# EAGLE design LED1 (EAGLE 9.6.0)
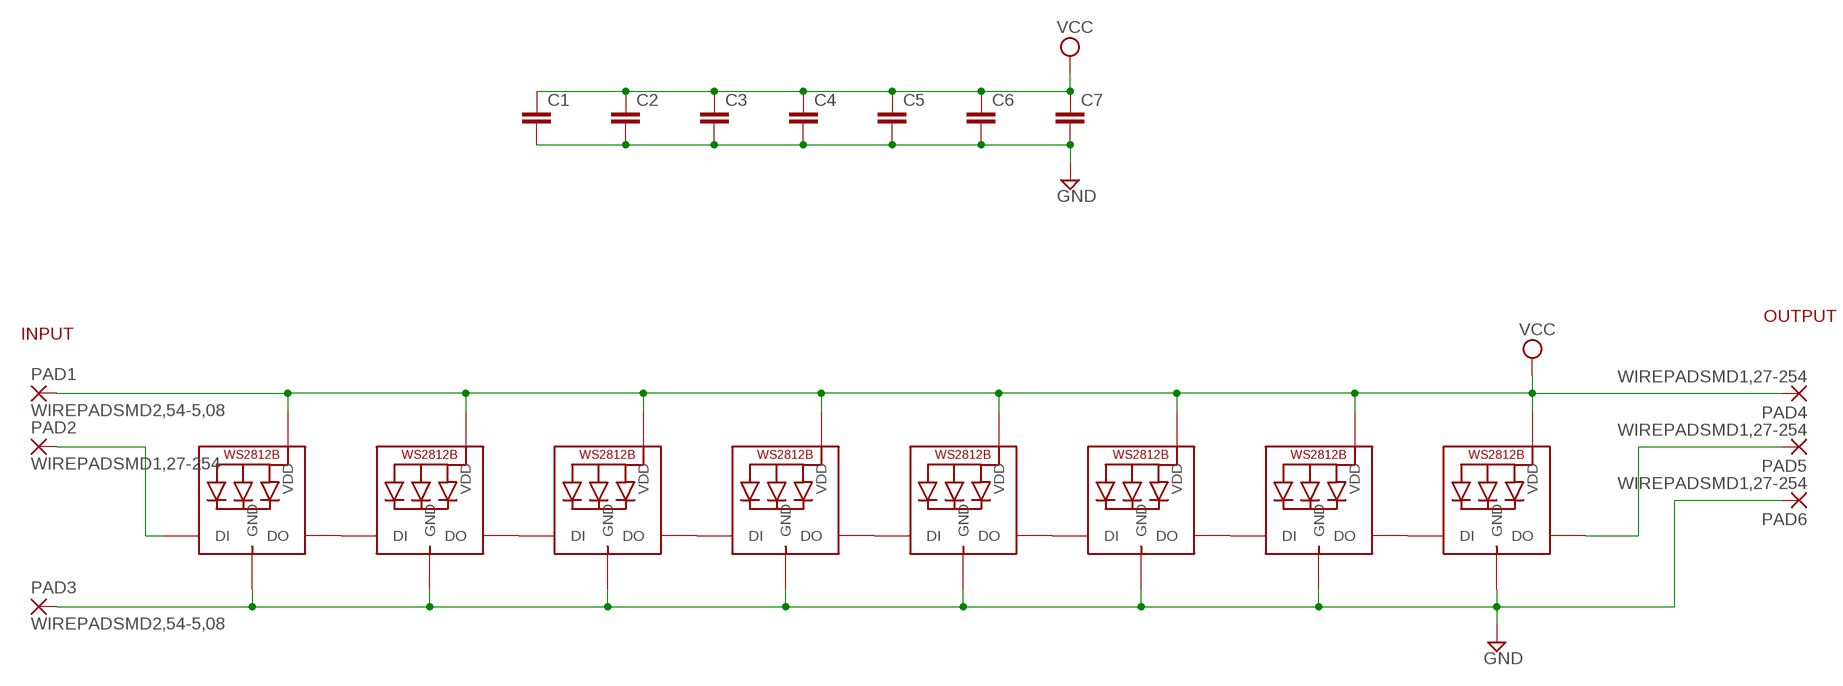
[diagram p0: schematic, sheet 1]

## Parts
C1  C-EUC0805K  [C0805K]
C2  C-EUC0805K  [C0805K]
C3  C-EUC0805K  [C0805K]
C4  C-EUC0805K  [C0805K]
C5  C-EUC0805K  [C0805K]
C6  C-EUC0805K  [C0805K]
C7  C-EUC0805K  [C0805K]
LED1  WS2812B5050  [WS2812B]
LED2  WS2812B5050  [WS2812B]
LED3  WS2812B5050  [WS2812B]
LED4  WS2812B5050  [WS2812B]
LED5  WS2812B5050  [WS2812B]
LED6  WS2812B5050  [WS2812B]
LED7  WS2812B5050  [WS2812B]
LED8  WS2812B5050  [WS2812B]
PAD1  WIREPADSMD2,54-5,08  [SMD2,54-5,08]
PAD2  WIREPADSMD1,27-254  [SMD1,27-2,54]
PAD3  WIREPADSMD2,54-5,08  [SMD2,54-5,08]
PAD4  WIREPADSMD1,27-254  [SMD1,27-2,54]
PAD5  WIREPADSMD1,27-254  [SMD1,27-2,54]
PAD6  WIREPADSMD1,27-254  [SMD1,27-2,54]

## Nets
GND: C1.2 C2.2 C3.2 C4.2 C5.2 C6.2 C7.2 LED1.3-GND(GND) LED2.3-GND(GND) LED3.3-GND(GND) LED4.3-GND(GND) LED5.3-GND(GND) LED6.3-GND(GND) LED7.3-GND(GND) LED8.3-GND(GND) PAD3.1(P) PAD6.1(P)
N$1: LED1.2-DOUT(DO) LED2.4-DIN(DI)
N$2: LED2.2-DOUT(DO) LED3.4-DIN(DI)
N$3: LED3.2-DOUT(DO) LED4.4-DIN(DI)
N$4: LED4.2-DOUT(DO) LED5.4-DIN(DI)
N$5: LED5.2-DOUT(DO) LED6.4-DIN(DI)
N$6: LED6.2-DOUT(DO) LED7.4-DIN(DI)
N$7: LED1.4-DIN(DI) PAD2.1(P)
N$8: LED8.2-DOUT(DO) PAD5.1(P)
N$12: LED7.2-DOUT(DO) LED8.4-DIN(DI)
VCC: C1.1 C2.1 C3.1 C4.1 C5.1 C6.1 C7.1 LED1.1-VDD(VDD) LED2.1-VDD(VDD) LED3.1-VDD(VDD) LED4.1-VDD(VDD) LED5.1-VDD(VDD) LED6.1-VDD(VDD) LED7.1-VDD(VDD) LED8.1-VDD(VDD) PAD1.1(P) PAD4.1(P)

## Notes on the sheet
- OUTPUT
- INPUT

## Library data of the parts
C1-C7 = rcl:C-EU: CAPACITOR, European symbol; SPICEPREFIX: C
LED1-LED8 = adafruit:WS2812B
PAD1-PAD6 = wirepad:WIREPAD: Wire PAD connect wire on PCB

## Board
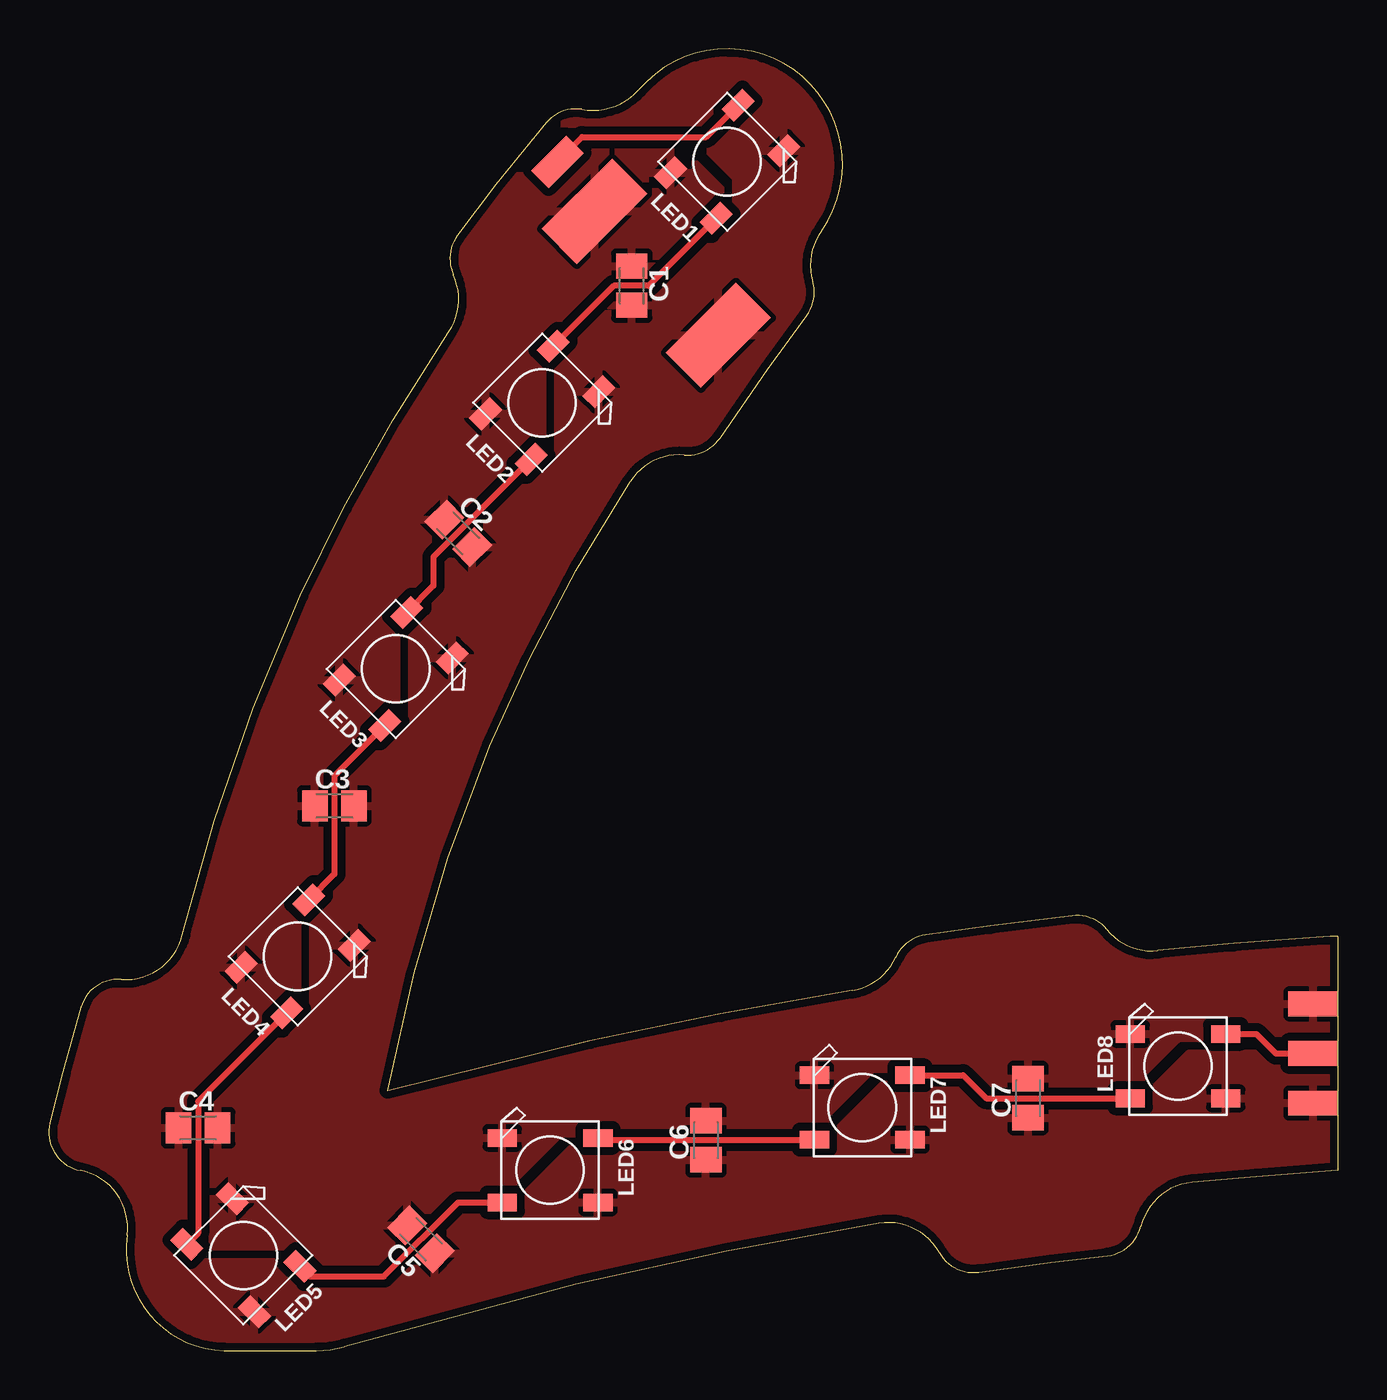
[diagram p1: board, top side]

Size 66.07 x 66.76 mm. Coordinates in mm from the lower left corner, seen from the top.
Outline: 8.98,0 13.71,0 arc17 15.15,0.21 27.01,3.4 34.72,5.1 42.53,6.53 arc-70 45.64,5.04 arc69 47.66,4.04 51.36,4.53 54.26,4.87 arc69 55.98,6.38 arc-70 58.6,8.63 61.88,8.93 66.07,9.24 66.07,21.25 arc4 65.69,21.24 60.73,20.87 56.85,20.52 arc-56 54.24,21.59 arc57 52.47,22.3 48.25,21.78 44.94,21.32 arc57 43.41,20.18 arc-56 41.17,18.47 34.42,17.27 27.73,15.88 17.37,13.33 18.73,19.36 20.46,25.23 22.61,31 24.66,35.5 27.04,40.02 29.82,44.57 arc-62 32.58,45.93 arc61 34.41,46.81 36.84,50.33 38.84,53.08 arc53 39.15,54.83 arc-52 39.61,57.43 arc175 30.24,64.65 arc-58 27.31,63.65 arc58 25.49,62.96 22.91,59.78 20.95,57.18 arc61 20.74,55.17 arc-58 20.51,52.26 17.65,47.74 15.12,43.23 12.89,38.71 10.47,32.95 8.47,27.16 6.85,21.31 arc-80 3.71,19.04 arc78 1.64,17.61 0.72,14.29 0.05,11.68 arc93 1.63,9.24 arc-87 4.01,5.92 arc96 8.98,0
Copper layers (1*16): Top 0.035559375mm / dielectric 1.6mm / Bottom 0.035559375mm
Design rules "jlcpcb2layer": minimum track width 5mil, minimum drill 8mil, track to track 5mil, track to pad 5mil, pad to pad 20mil, via to via 10mil, smd to smd 5mil, copper to edge 8mil, drill to drill 20mil, minimum pad ring 12mil, minimum via ring 5mil, stop-mask expansion 2.5mil, vias tented up to drill 20mil, thermal gap 10mil

### Footprints (pad centres in the part's own frame; a part is rotated, then mirrored left to right if it is on the bottom)
C0805K = smd 1.3 x 1.6: 1 -1,0; 2 1,0
WS2812B = smd 1.5 x 0.9: 1-VDD 2.45,-1.65; 2-DOUT 2.45,1.65; 3-GND -2.45,1.65; 4-DIN -2.45,-1.65
SMD2,54-5,08 = smd 2.54 x 5.08: 1 0,0
SMD1,27-2,54 = smd 1.27 x 2.54: 1 0,0

### Placement (x,y rotation side)
C1  29.88,54.61 270 top
C2  20.99,41.91 315 top
C3  14.64,27.94 0 top
C4  7.65,11.43 0 top
C5  19.08,5.71 135 top
C6  33.69,10.79 90 top
C7  50.2,12.95 90 top
LED1  34.77,60.97 225 top
LED2  25.29,48.61 225 top
LED3  17.78,34.96 225 top
LED4  12.76,20.22 225 top
LED5  9.98,4.89 315 top
LED6  25.7,9.26 0 top
LED7  41.7,12.48 0 top
LED8  57.88,14.59 0 top
PAD1  27.97,58.42 135 top
PAD2  26.07,60.96 135 top
PAD3  34.32,52.07 135 top
PAD4  64.8,12.7 90 top
PAD5  64.8,15.25 90 top
PAD6  64.8,17.78 90 top

### Tracks (layer width: path | path; a pad name or v marks a point on that pad's centre or on a via)
GND
  pour Top (isolate 0.406, rank 2): 1.63,9.24 arc-93 0.05,11.68 0.72,14.29 1.64,17.61 arc-78 3.71,19.04 arc80 6.85,21.31 8.47,27.16 10.47,32.95 12.89,38.71 15.12,43.22 17.65,47.74 20.51,52.26 arc58 20.74,55.17 arc-61 20.95,57.18 22.91,59.78 25.49,62.96 arc-58 27.31,63.65 arc58 30.24,64.65 arc-175 39.61,57.43 arc52 39.15,54.83 arc-53 38.8,52.86 34.41,46.81 arc-61 32.58,45.93 arc62 29.82,44.57 27.04,40.02 24.66,35.5 22.61,31 20.46,25.23 18.73,19.37 17.37,13.33 27.73,15.88 34.42,17.27 41.17,18.47 arc56 43.41,20.18 arc-57 44.94,21.32 48.25,21.78 52.47,22.31 arc-57 54.24,21.59 arc56 56.85,20.52 60.73,20.87 65.69,21.24 arc-4 66.07,21.25 66.07,9.24 61.88,8.93 58.6,8.63 arc70 55.98,6.38 arc-69 54.26,4.87 51.36,4.53 47.66,4.03 arc-69 45.64,5.04 arc70 42.53,6.53 34.72,5.1 27.01,3.4 15.15,0.21 arc-17 13.71,0 8.98,0 arc-96 4.01,5.92 arc87
N$1
  Top 0.305: LED1.2-DOUT 30.74,54.61 28.96,54.61 LED2.4-DIN
N$2
  Top 0.305: LED2.2-DOUT 19.72,40.7 19.72,39.23 LED3.4-DIN
N$3
  Top 0.305: LED3.2-DOUT 14.64,29.48 14.64,24.44 LED4.4-DIN
N$4
  Top 0.305: LED4.2-DOUT 7.65,12.78 7.65,6.03 LED5.4-DIN
N$5
  Top 0.305: LED5.2-DOUT 13.39,3.81 17.18,3.81 20.98,7.61 LED6.4-DIN
N$6
  Top 0.305: LED6.2-DOUT 28.23,10.83 LED7.4-DIN
N$7
  Top 0.305: PAD2.1 27.34,62.23 33.69,62.23 LED1.4-DIN
N$8
  Top 0.305: LED8.2-DOUT 61.9,16.24 62.89,15.24 PAD5.1
N$12
  Top 0.305: LED7.2-DOUT 46.87,14.13 48.05,12.94 LED8.4-DIN
VCC
  pour Top (isolate 0.406): 24.8,62.23 31.78,62.23 34.96,59.05 34.96,58.8 30.77,54.61 28.99,54.61 25.31,50.93 25.31,46.35 19.72,40.77 19.72,39.24 17.81,37.34 17.81,32.64 14.64,29.46 14.64,24.51 12.73,22.61 12.73,17.78 7.65,12.7 7.65,5.97 7.14,5.46 7.02,5.46 7.91,4.57 12.61,4.57 13.37,3.81 17.18,3.81 20.99,7.62 24.04,7.62 27.34,10.92 40.04,10.92 43.21,14.1 46.9,14.1 48.04,12.95 56.17,12.95 58.45,15.24 66.07,15.24 66.07,-1.27 55.91,-11.43 -20.92,-11.43 -23.46,-8.89 -23.46,13.97

### Text on the board
tTest: DIN | 5V | GND | GND | DOUT | 5V